# EAGLE schematic SMART SOCKET (EAGLE 7.6.0)

## Sheet 1 of 2
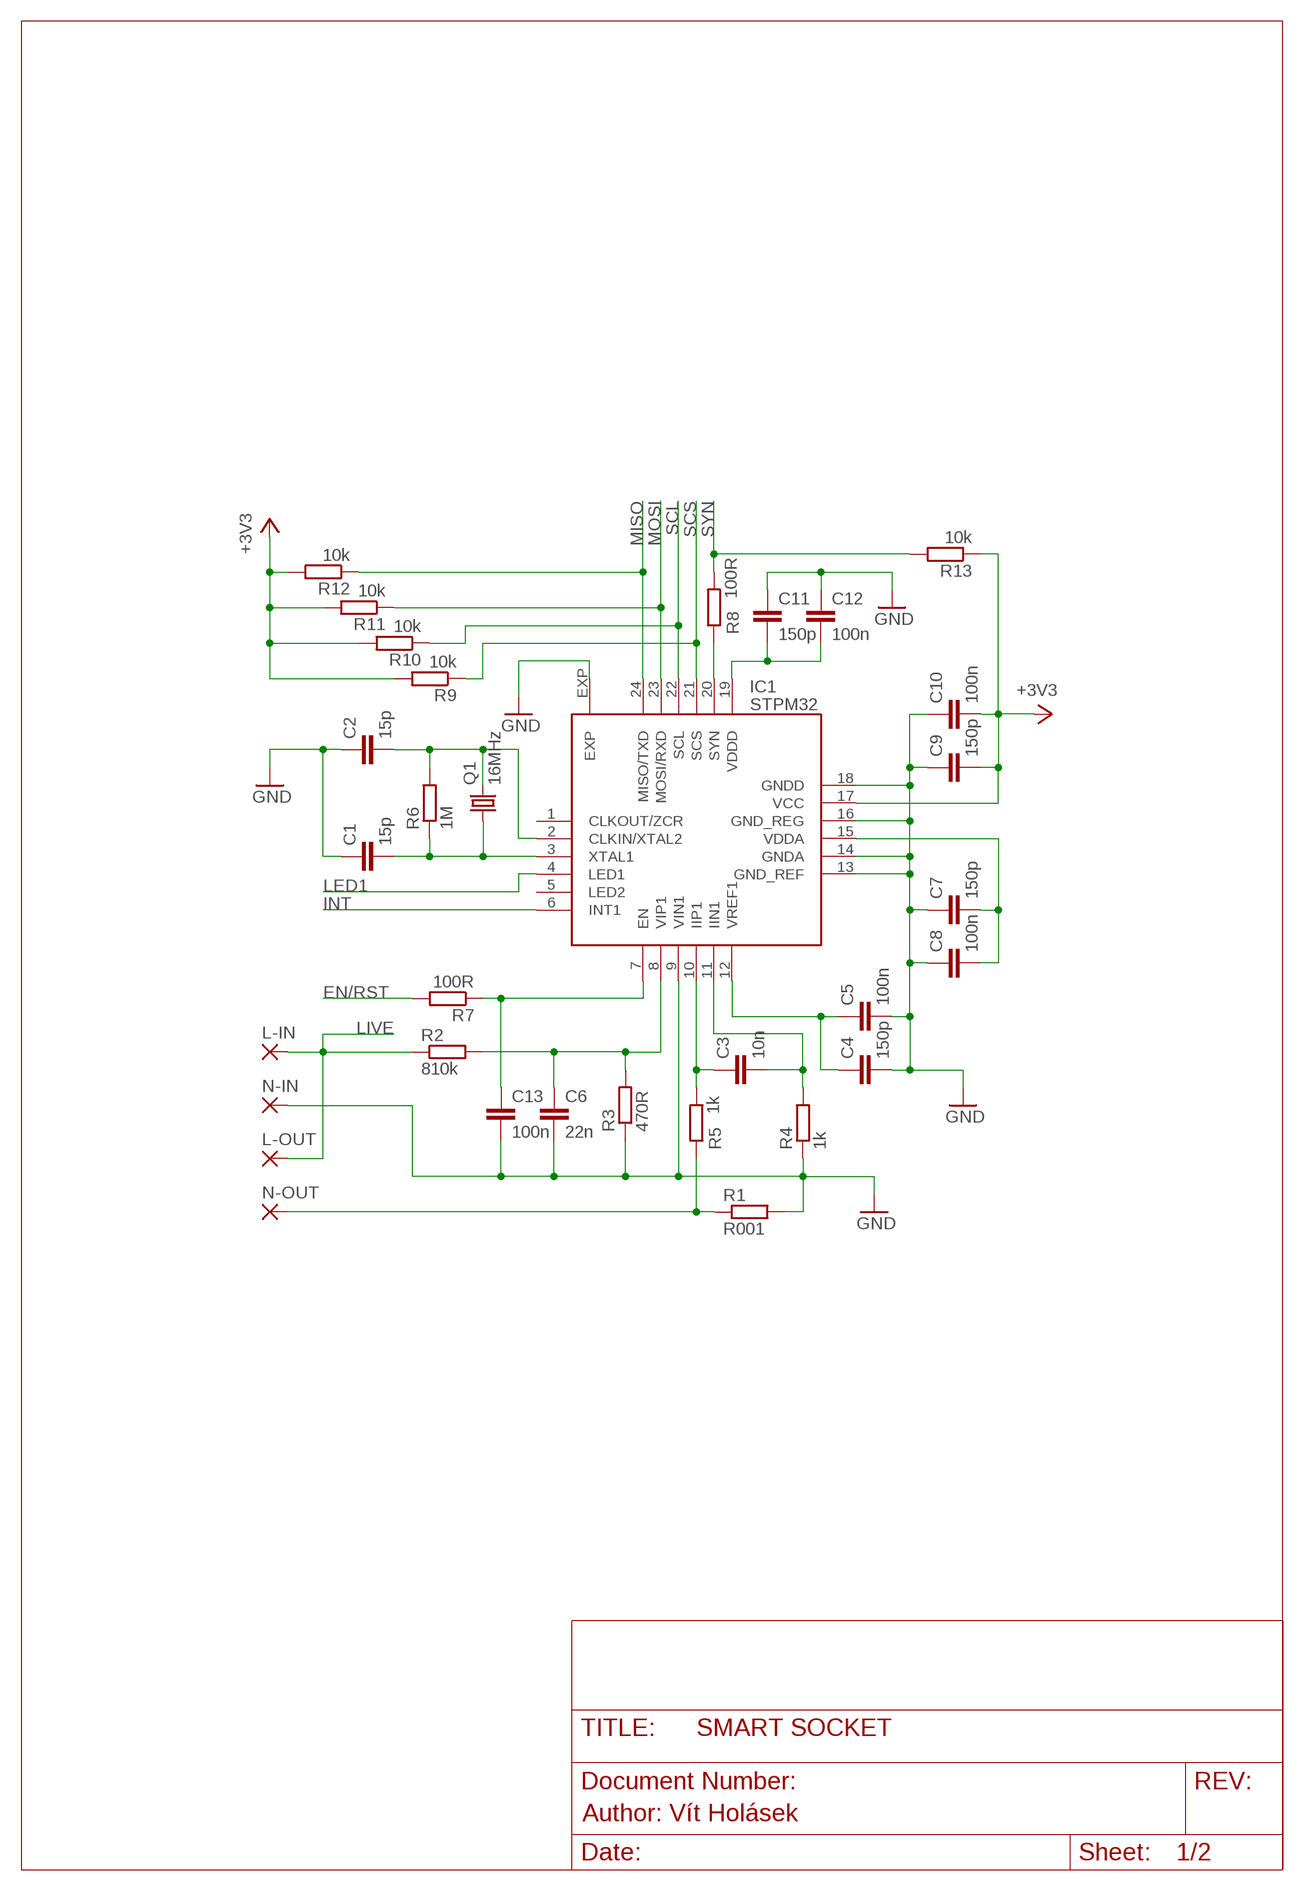
[diagram p0: schematic, sheet 1]

### Parts
C1  15p  C-EUC0402  [C0402]
C2  15p  C-EUC0402  [C0402]
C3  10n  C-EUC0402  [C0402]
C4  150p  C-EUC0402  [C0402]
C5  100n  C-EUC0402  [C0402]
C6  22n  C-EUC0603  [C0603]
C7  150p  C-EUC0402  [C0402]
C8  100n  C-EUC0402  [C0402]
C9  150p  C-EUC0402  [C0402]
C10  100n  C-EUC0402  [C0402]
C11  150p  C-EUC0402  [C0402]
C12  100n  C-EUC0402  [C0402]
C13  100n  C-EUC0603  [C0603]
IC1  STPM32  [QFN24L]
L-IN  2,54/1,1  [2,54/1,1]
L-OUT  2,54/1,1  [2,54/1,1]
N-IN  2,54/1,1  [2,54/1,1]
N-OUT  2,54/1,1  [2,54/1,1]
Q1  16MHz  CRYSTALCTS406  [CTS406]
R1  R001  R-EU_R2512  [R2512]
R2  810k  R-EU_R0603  [R0603]
R3  470R  R-EU_R0603  [R0603]
R4  1k  R-EU_R0402  [R0402]
R5  1k  R-EU_R0402  [R0402]
R6  1M  R-EU_R0402  [R0402]
R7  100R  R-EU_R0402  [R0402]
R8  100R  R-EU_R0402  [R0402]
R9  10k  R-EU_R0402  [R0402]
R10  10k  R-EU_R0402  [R0402]
R11  10k  R-EU_R0402  [R0402]
R12  10k  R-EU_R0402  [R0402]
R13  10k  R-EU_R0402  [R0402]

### Nets
+3V3: C9.2 C10.2 IC1.17(VCC) R9.2 R10.2 R11.2 R12.2 R13.1 ; also sheet 2
EN/RST: R7.2 ; also sheet 2
GND: C1.1 C2.1 C4.2 C5.2 C6.2 C7.1 C8.1 C9.1 C10.1 C11.1 C12.1 C13.2 IC1.9(VIN1) IC1.13(GND_REF) IC1.14(GNDA) IC1.16(GND_REG) IC1.18(GNDD) IC1.EXP N-IN.1(P) R1.2 R3.1 R4.1 ; also sheet 2
INT: IC1.6(INT1)
LED1: IC1.4(LED1)
LIVE: L-IN.1(P) L-OUT.1(P) R2.1 ; also sheet 2
MISO: IC1.24(MISO/TXD) R12.1 ; also sheet 2
MOSI: IC1.23(MOSI/RXD) R11.1 ; also sheet 2
N$1: C2.2 IC1.2(CLKIN/XTAL2) Q1.3 R6.2
N$2: C4.1 C5.1 IC1.12(VREF1)
N$3: C1.2 IC1.3(XTAL1) Q1.1 R6.1
N$4: C6.1 IC1.8(VIP1) R2.2 R3.2
N$5: N-OUT.1(P) R1.1 R5.1
N$6: C3.1 IC1.10(IIP1) R5.2
N$7: C3.2 IC1.11(IIN1) R4.2
N$8: IC1.20(SYN) R8.1
N$9: C13.1 IC1.7(EN) R7.1
N$10: C7.2 C8.2 IC1.15(VDDA)
N$11: C11.2 C12.2 IC1.19(VDDD)
SCL: IC1.22(SCL) R10.1 ; also sheet 2
SCS: IC1.21(SCS) R9.1 ; also sheet 2
SYN: R8.2 R13.2 ; also sheet 2
Unconnected: IC1.1(CLKOUT/ZCR) IC1.5(LED2)

### Notes on the sheet
- Author: Vít Holásek

## Sheet 2 of 2
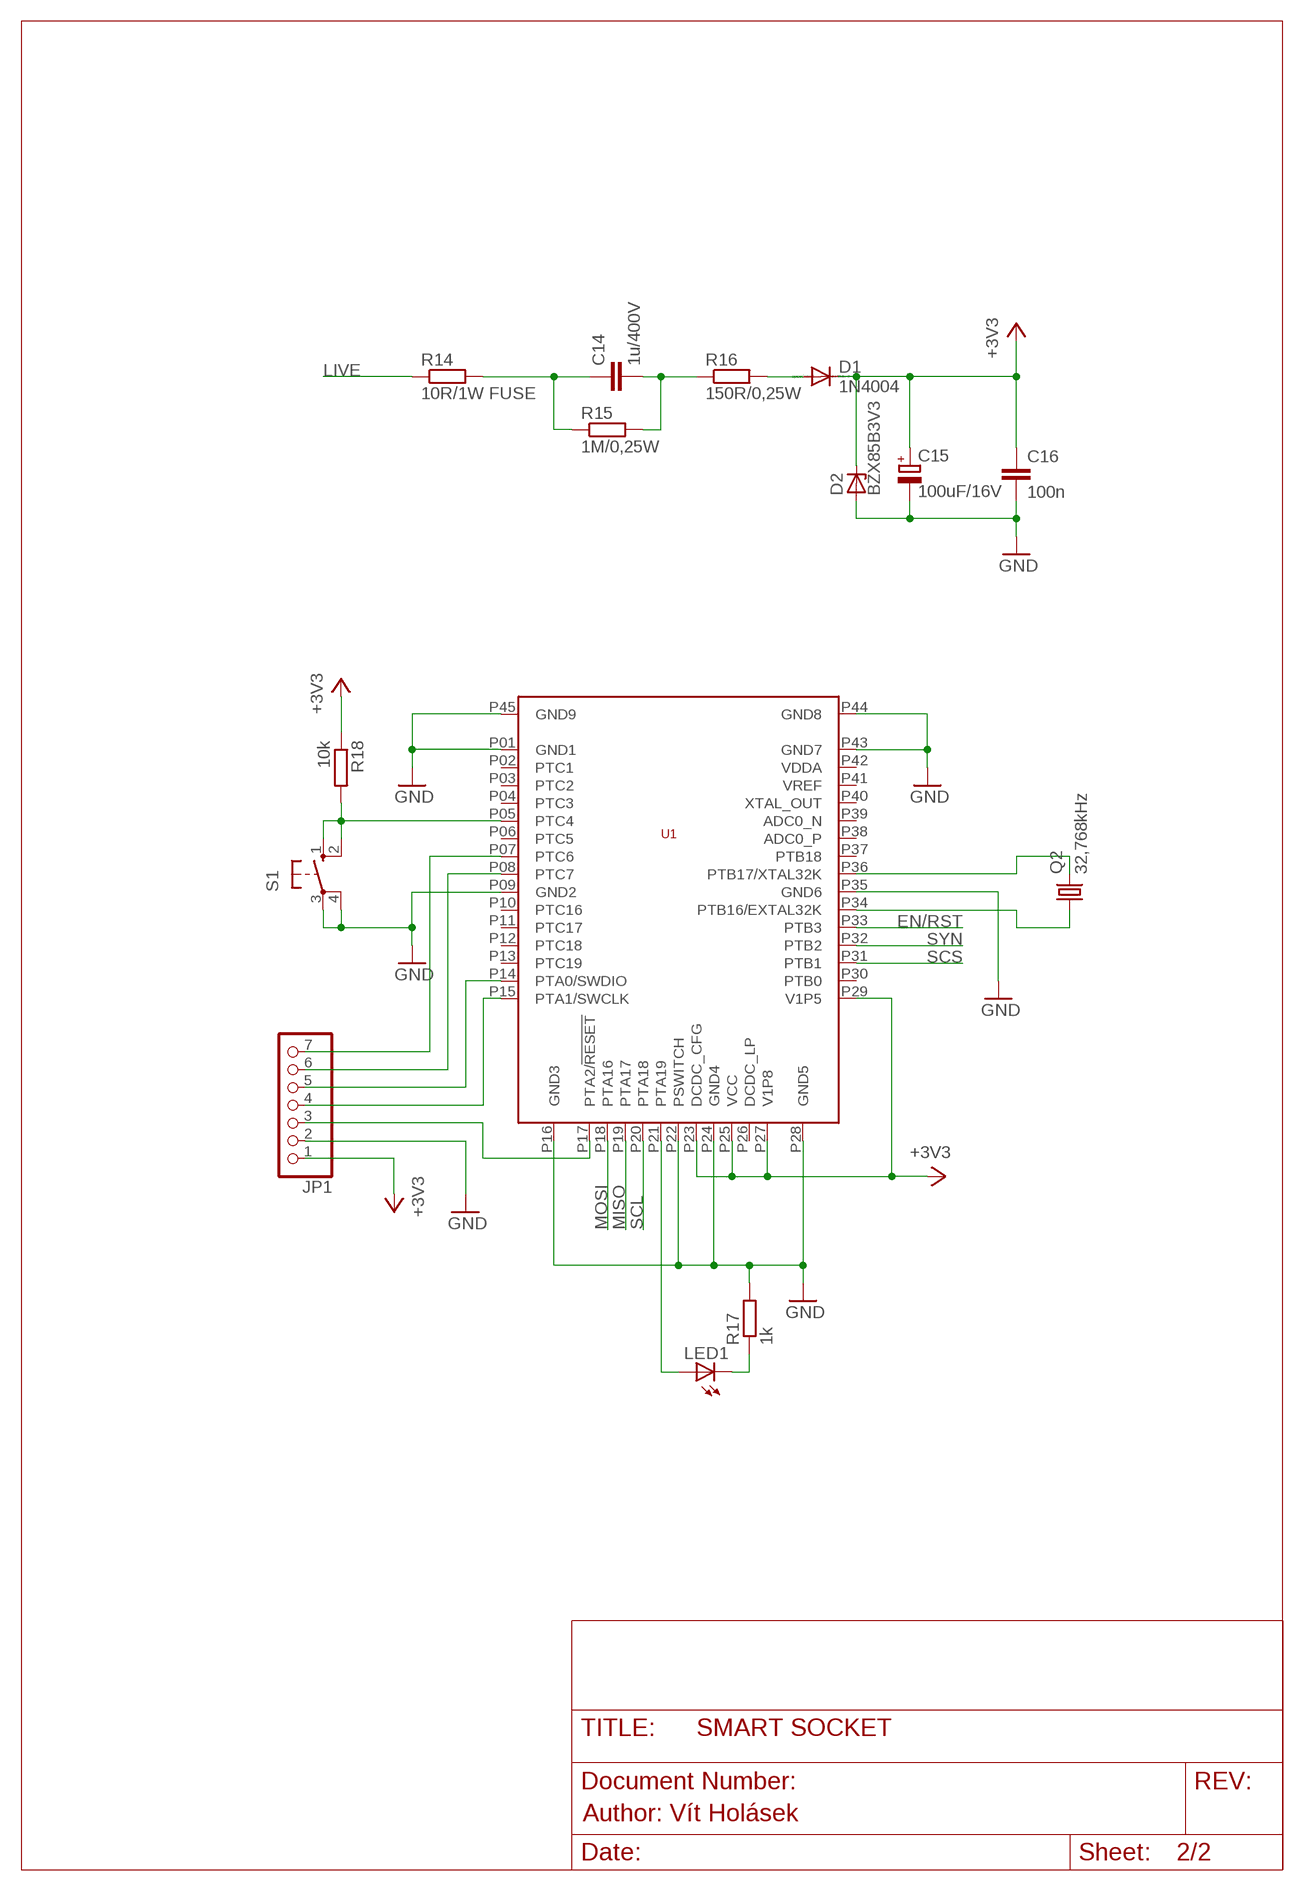
[diagram p1: schematic, sheet 2]

### Parts
C14  1u/400V  C-EUC0805  [C0805]
C15  100uF/16V  CPOL-EUE5-8.5  [E5-8,5]
C16  100n  C-EUC0603  [C0603]
D1  1N4004  [DO41-10]
D2  BZX85B3V3  ZENER-DIODEDO41Z10  [DO41Z10]
JP1  PINHD-1X7  [1X07]
LED1  LED3MM  [LED3MM]
Q2  32,768kHz  CRYSTALTC26V  [TC26V]
R14  10R/1W FUSE  R-EU_0204/7  [0204/7]
R15  1M/0,25W  R-EU_R0805  [R0805]
R16  150R/0,25W  R-EU_R0805  [R0805]
R17  1k  R-EU_R0402  [R0402]
R18  10k  R-EU_R0402  [R0402]
S1  10-XX  [B3F-10XX]
U1  R41Z-T  [R41Z]

### Nets
+3V3: C15.+ C16.1 D1.C D2.C JP1.1 R18.1 U1.P23(DCDC_CFG) U1.P25(VCC) U1.P27(V1P8) U1.P29(V1P5) ; also sheet 1
EN/RST: U1.P33(PTB3) ; also sheet 1
GND: C15.- C16.2 D2.A JP1.2 R17.2 S1.3(P) S1.4(P1) U1.P01(GND1) U1.P09(GND2) U1.P16(GND3) U1.P22(PSWITCH) U1.P24(GND4) U1.P28(GND5) U1.P35(GND6) U1.P43(GND7) U1.P44(GND8) U1.P45(GND9) ; also sheet 1
LIVE: R14.1 ; also sheet 1
MISO: U1.P19(PTA17) ; also sheet 1
MOSI: U1.P18(PTA16) ; also sheet 1
N$12: C14.2 R15.2 R16.1
N$13: C14.1 R14.2 R15.1
N$14: D1.A R16.2
N$15: Q2.2 U1.P36(PTB17/XTAL32K)
N$16: Q2.1 U1.P34(PTB16/EXTAL32K)
N$17: LED1.A U1.P21(PTA19)
N$18: LED1.K(C) R17.1
N$19: R18.2 S1.1(S) S1.2(S1) U1.P05(PTC4)
N$20: JP1.7 U1.P07(PTC6)
N$21: JP1.6 U1.P08(PTC7)
N$22: JP1.5 U1.P14(PTA0/SWDIO)
N$23: JP1.4 U1.P15(PTA1/SWCLK)
N$24: JP1.3 U1.P17(PTA2/!RESET!)
SCL: U1.P20(PTA18) ; also sheet 1
SCS: U1.P31(PTB1) ; also sheet 1
SYN: U1.P32(PTB2) ; also sheet 1
Unconnected: U1.P02(PTC1) U1.P03(PTC2) U1.P04(PTC3) U1.P06(PTC5) U1.P10(PTC16) U1.P11(PTC17) U1.P12(PTC18) U1.P13(PTC19) U1.P26(DCDC_LP) U1.P30(PTB0) U1.P37(PTB18) U1.P38(ADC0_P) U1.P39(ADC0_N) U1.P40(XTAL_OUT) U1.P41(VREF) U1.P42(VDDA)

### Notes on the sheet
- Author: Vít Holásek

## Library data of the parts
C1-C14 C16 = resistor:C-EU: CAPACITOR, European symbol
C15 = resistor:CPOL-EU: POLARIZED CAPACITOR, European symbol
D1 = diode:1N4004: DIODE general purpose rectifier, 1 A
D2 = diode:ZENER-DIODE: Z-Diode
IC1 = smart_socket:STPM32: ASSP for metering applications with 2 independent 24-bit 2nd order sigma-delta ADCs, 4 MHz OSF and embedded PGLNA
JP1 = pinhead:PINHD-1X7: PIN HEADER
L-IN L-OUT N-IN N-OUT = wirepad:2,54/1,1: THROUGH-HOLE PAD
LED1 = led:LED: LED OSRAM: - CHIPLED LG R971, LG N971, LY N971, LG Q971, LY Q971, LO R971, LY R971 LH N974, LH R974 LS Q976, LO Q976, LY Q976 LO Q996 - Hyper CHIPLED LW Q18S LB Q993, LB Q99A, LB R99A - SideLED LS A670, LO A670, LY A670, LG A670, LP A670 LB A673, LV A673, LT A673, LW A673 LH A674 LY A675 LS A676, LA A676, LO A676, LY A676, LW A676 LS A679, LY A679, LG A679 - Hyper Micro SIDELED® LS Y876, LA Y876, LO Y876, LY Y876 LT Y87S - SmartLED LW L88C, LW L88S LB L89C, LB L89S, LG L890 LS L89K, LO L89K, LY L89K LS L896, LA L896, LO L896, LY L896 - TOPLED LS T670, LO T670, LY T670, LG T670, LP T670 LSG T670, LSP T670, LSY T670, LOP T670, LYG T670 LG T671, LOG T671, LSG T671 LB T673, LV T673, LT T673, LW T673 LH T674 LS T676, LA T676, LO T676, LY T676, LB T676, LH T676, LSB T676, LW T676 LB T67C, LV T67C, LT T67C, LS T67K, LO T67K, LY T67K, LW E67C LS E67B, LA E67B, LO E67B, LY E67B, LB E67C, LV E67C, LT E67C LW T67C LS T679, LY T679, LG T679 LS T770, LO T770, LY T770, LG T770, LP T770 LB T773, LV T773, LT T773, LW T773 LH T774 LS E675, LA E675, LY E675, LS T675 LS T776, LA T776, LO T776, LY T776, LB T776 LHGB T686 LT T68C, LB T68C - Hyper Mini TOPLED® LB M676 - Mini TOPLED Santana® LG M470 LS M47K, LO M47K, LY M47K Source: http://www.osram.convergy.de LUXEON: - LUMILED® LXK2-PW12-R00, LXK2-PW12-S00, LXK2-PW14-U00, LXK2-PW14-V00 LXK2-PM12-R00, LXK2-PM12-S00, LXK2-PM14-U00 LXK2-PE12-Q00, LXK2-PE12-R00, LXK2-PE12-S00, LXK2-PE14-T00, LXK2-PE14-U00 LXK2-PB12-K00, LXK2-PB12-L00, LXK2-PB12-M00, LXK2-PB14-N00, LXK2-PB14-P00, LXK2-PB14-Q00 LXK2-PR12-L00, LXK2-PR12-M00, LXK2-PR14-Q00, LXK2-PR14-R00 LXK2-PD12-Q00, LXK2-PD12-R00, LXK2-PD12-S00 LXK2-PH12-R00, LXK2-PH12-S00 LXK2-PL12-P00, LXK2-PL12-Q00, LXK2-PL12-R00 Source: www.luxeon.com KINGBRIGHT: KA-3528ASYC Source: www.kingbright.com
Q1 Q2 = crystal:CRYSTAL: CRYSTAL; OC_FARNELL: unknown; OC_NEWARK: unknown
R1-R18 = resistor:R-EU_: RESISTOR, European symbol
S1 = switch-omron:10-XX: OMRON SWITCH; MPN: B3F-1000; OC_FARNELL: 176432; OC_NEWARK: 36M3542
U1 = R41Z:R41Z